# Altium schematic sheet Crossover.SchDoc
size C
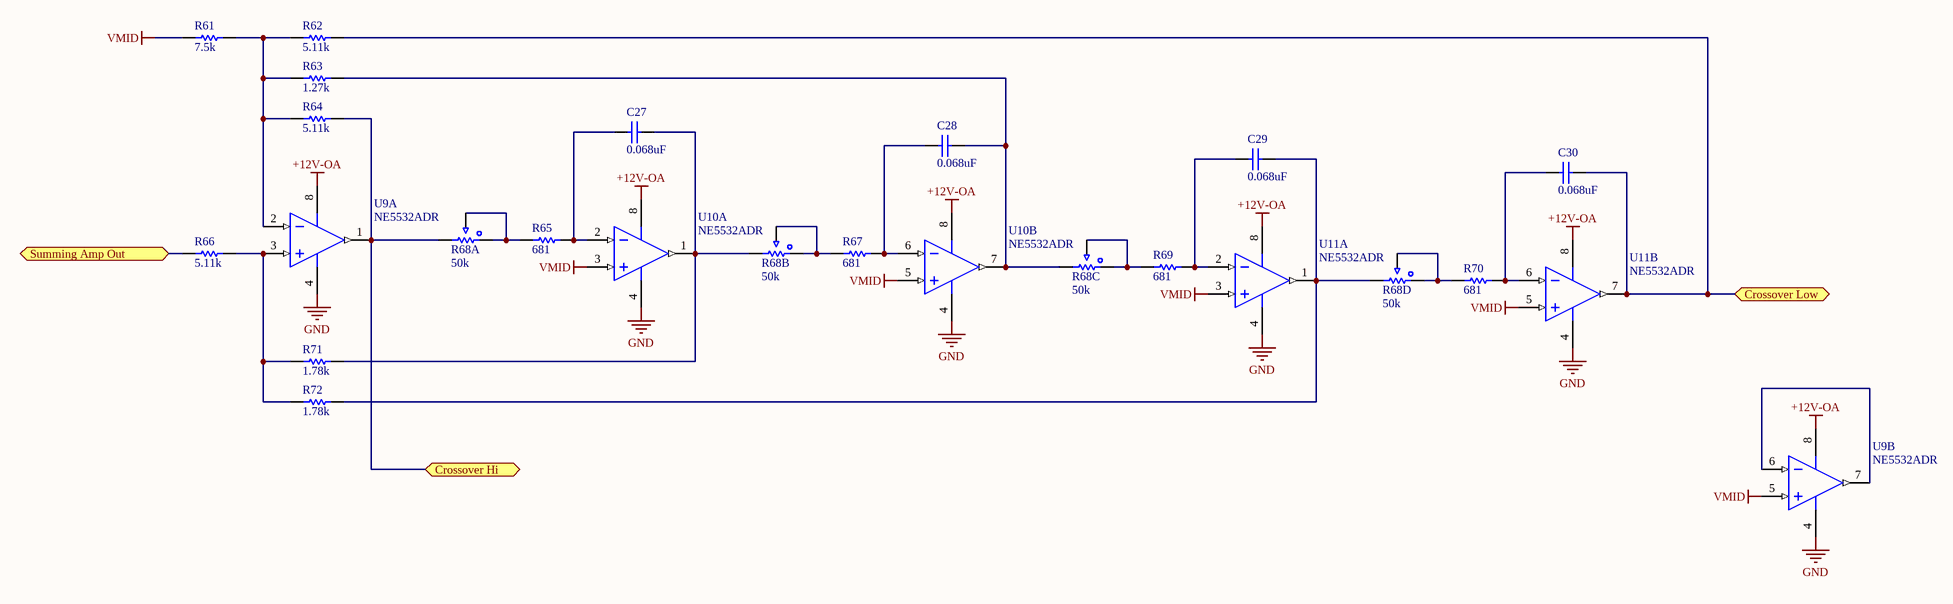
[diagram p0: Crossover.SchDoc]

## Parts
C27  0.068uF  [RESC3216X70X50NL05T20]
C28  0.068uF  [RESC3216X70X50NL05T20]
C29  0.068uF  [RESC3216X70X50NL05T20]
C30  0.068uF  [RESC3216X70X50NL05T20]
R61  7.5k  [RESC1609X55X28LL05T18]
R62  5.11k  [PCB-dm6f2vlmfnf97yy2nsh5-1]
R63  1.27k  [RESC1609X55X28LL05T18]
R64  5.11k  [PCB-dm6f2vlmfnf97yy2nsh5-1]
R65  681  [RESC1609X55X28LL05T18]
R66  5.11k  [PCB-dm6f2vlmfnf97yy2nsh5-1]
R67  681  [RESC1609X55X28LL05T18]
R68  50k  [PCB-3c7eria7znpasna51pjn-1]  (parts A,B,C,D of 4)
R69  681  [RESC1609X55X28LL05T18]
R70  681  [RESC1609X55X28LL05T18]
R71  1.78k  [RESC1609X55X28LL05T18]
R72  1.78k  [RESC1609X55X28LL05T18]
U9  NE5532ADR  [TI-D8_L]  (parts A,B of 2)
U10  NE5532ADR  [TI-D8_L]  (parts A,B of 2)
U11  NE5532ADR  [TI-D8_L]  (parts A,B of 2)

## Ports
Crossover Hi, Crossover Low, Summing Amp Out

## Nets
+12V-OA: U9.8(VCC+) U10.8(VCC+) U11.8(VCC+)
GND: U9.4(VCC-) U10.4(VCC-) U11.4(VCC-)
VMID: R61.1 U9.5(IN2+) U10.3(IN1+) U10.5(IN2+) U11.3(IN1+) U11.5(IN2+)
Crossover Hi: R64.2 R68.R1_3 U9.1(OUT1) ; port Crossover Hi
Crossover Low: C30.2 R62.2 U11.7(OUT2) ; port Crossover Low
Summing Amp Out: R66.1 ; port Summing Amp Out
NetC27_1: C27.1 R65.2 U10.2(IN1-)
NetC27_2: C27.2 R68.R2_3 R71.2 U10.1(OUT1)
NetC28_1: C28.1 R67.2 U10.6(IN2-)
NetC28_2: C28.2 R63.2 R68.R3_3 U10.7(OUT2)
NetC29_1: C29.1 R69.2 U11.2(IN1-)
NetC29_2: C29.2 R68.R4_3 R72.2 U11.1(OUT1)
NetC30_1: C30.1 R70.2 U11.6(IN2-)
NetR61_2: R61.2 R62.1 R63.1 R64.1 U9.2(IN1-)
NetR65_1: R65.1 R68.R1_1 R68.R1_2
NetR66_2: R66.2 R71.1 R72.1 U9.3(IN1+)
NetR67_1: R67.1 R68.R2_1 R68.R2_2
NetR68_R3_1: R68.R3_1 R68.R3_2 R69.1
NetR68_R4_1: R68.R4_1 R68.R4_2 R70.1
NetU9_6: U9.6(IN2-) U9.7(OUT2)

## Library data of the parts
C27-C30 = CMP-f94231c42cf32685-1: C Series 1206 50 V 0.068 uF ±5% Tolerance C0G SMT Multilayer Ceramic Capacitor; Voltage Rating (DC): 50.0 V; RoHS: Compliant
R61 = CMP-2e48e5fbd8dbf18f-1: Res Thin Film 0603 7.5K Ohm 0.1% 0.1W(1/10W) ±25ppm/C SMD Automotive T/R; Manufacturer: Vishay; Manufacturer Part Number: MCT0603MD7501BP100; Octopart URL: http://octopart.com/mct0603md7501bp100-vishay-45732853; Case/Package: 0603; Packaging: Reel; RoHS: Compliant; OctopartID: 2e48e5fbd8dbf18f
R62 R64 R66 = CMP-3220f9ecb51bede7-1: Res Thin Film 0603 5.11K Ohm 0.1% 1/10W ±25ppm/°C Molded SMD SMD Paper T/R; Manufacturer Part Number: MCT06030D5111BP100; Power Rating: 100 mW; Octopart URL: http://octopart.com/mct06030d5111bp100-vishay-46572125; Packaging: Tape & Reel (TR); RoHS: Compliant
R63 = CMP-169edd529233c959-1: Res Thin Film 0603 1.27K Ohm 0.1% 1/10W ±25ppm/°C Molded SMD SMD Paper T/R; Manufacturer Part Number: MCT06030D1271BP100; Voltage Rating (DC): 50.0 V; Resistance: 1.27 kΩ; Temperature Coefficient: 25.0 ppm/°C; Power Rating: 100 mW; Lead-Free Status: Lead Free; Size-Height: 450 µm; Case/Package: 0603; Octopart URL: http://octopart.com/mct06030d1271bp100-vishay-46571979; Mounting Style: Surface Mount; RoHS: Compliant; OctopartID: 169edd529233c959; Size-Width: 850 µm; Resistance Tolerance: ±0.1%
R65 R67 R69 R70 = CMP-437288bec46a9cb5-1: Res Thin Film 0603 681 Ohm 0.1% 1/10W ±25ppm/°C Molded SMD SMD Paper T/R; OctopartID: 437288bec46a9cb5; Size-Height: 450 µm; Mounting Style: Surface Mount
R68 = CMP-1b48d3c31cb2c48f-2: PTD90 Series 9mm Multi Ganged Potentiometer 50K Ohm 20% 0.05 W 1(Elec)/1(Mech)Turn Panel Mount/Thru-Hole Tray; Octopart URL: http://octopart.com/ptd904-2015k-b503-bourns-25240220; OctopartID: 1b48d3c31cb2c48f; Resistance: 50k
R71 R72 = CMP-0169caa585e3deae-1: Res Thin Film 0603 1.78K Ohm 0.1% 1/10W ±25ppm/°C Molded SMD Paper T/R; Power Rating: 100 mW
U9-U11 = CMP-13597030-2: Dual Low-Noise Operational Amplifier, 10 to 30 V, 0 to 70 degC, 8-pin SOIC (D8), Green (RoHS & no Sb/Br); Bandwidth: 10000000.0 Hz; Lead-Free Status: Lead Free; Number of Channels: 2; Slew Rate: 9.0 V/μs; Supply Voltage (DC): 30.0 V; Gain Bandwidth Product: 10000000.0 Hz; Lifecycle Status: Active; Mounting Style: Surface Mount; Number of Circuits: 2; Number of Pins: 8; Octopart Url: https://octopart.com/ne5532adr-texas+instruments-409175; OctopartID: 270fee033c3ef8c8; Packaging: Tape & Reel (TR); REACH SVHC Compliance: No SVHC; RoHS: Compliant